# EAGLE design NOROTAE-leddriver (EAGLE 9.3.0)
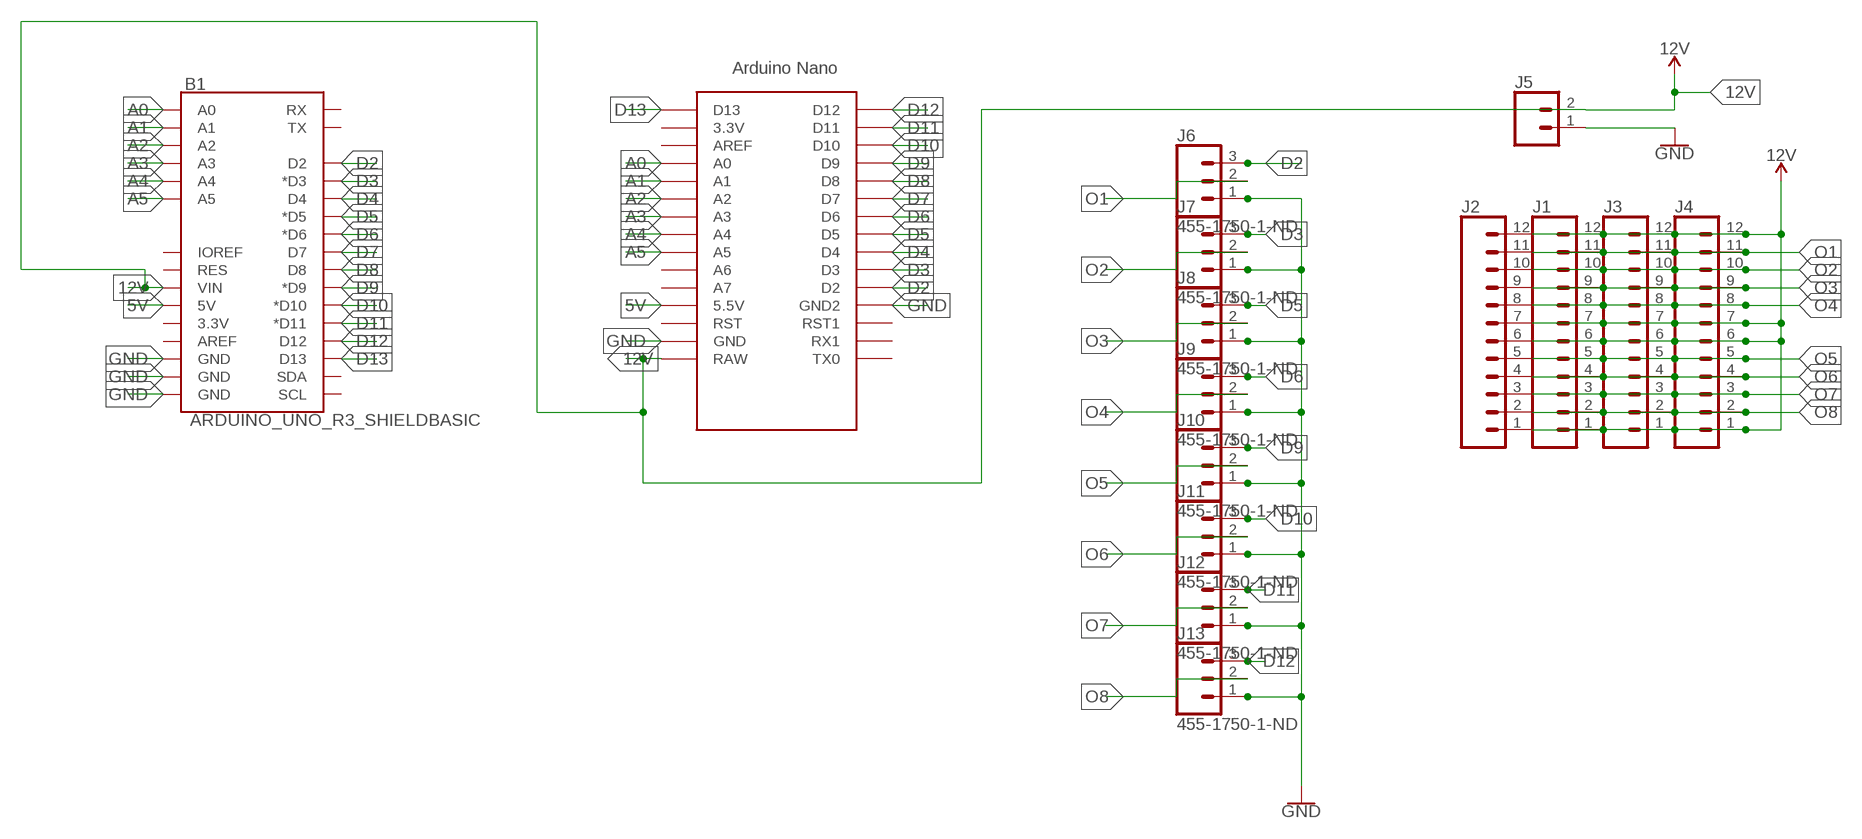
[diagram p0: schematic, sheet 1]

## Parts
B1  ARDUINO_UNO_R3_SHIELDBASIC  [UNO_R3_SHIELD]
J1  CONN_12  [1X12]
J2  CONN_12  [1X12]
J3  CONN_12  [1X12]
J4  CONN_12  [1X12]
J5  CONN_02  [1X02]
J6  455-1750-1-ND  CONN_03  [1X03]
J7  455-1750-1-ND  CONN_03  [1X03]
J8  455-1750-1-ND  CONN_03  [1X03]
J9  455-1750-1-ND  CONN_03  [1X03]
J10  455-1750-1-ND  CONN_03  [1X03]
J11  455-1750-1-ND  CONN_03  [1X03]
J12  455-1750-1-ND  CONN_03  [1X03]
J13  455-1750-1-ND  CONN_03  [1X03]
U$1  NANO  [NANO]

## Nets
5V: B1.5V U$1.5V(5.5V)
12V: B1.VIN J1.1 J1.6 J1.7 J1.12 J2.1 J2.6 J2.7 J2.12 J3.1 J3.6 J3.7 J3.12 J4.1 J4.6 J4.7 J4.12 J5.2 U$1.RAW
A0: B1.A0 U$1.A0
A1: B1.A1 U$1.A1
A2: B1.A2 U$1.A2
A3: B1.A3 U$1.A3
A4: B1.A4 U$1.A4
A5: B1.A5 U$1.A5
D2: B1.D2 J6.3 U$1.D2
D3: B1.D3(*D3) J7.3 U$1.D3
D4: B1.D4 U$1.D4
D5: B1.D5(*D5) J8.3 U$1.D5
D6: B1.D6(*D6) J9.3 U$1.D6
D7: B1.D7 U$1.D7
D8: B1.D8 U$1.D8
D9: B1.D9(*D9) J10.3 U$1.D9
D10: B1.D10(*D10) J11.3 U$1.D10
D11: B1.D11(*D11) J12.3 U$1.D11
D12: B1.D12 J13.3 U$1.D12
D13: B1.D13 U$1.D13
GND: B1.GND@0(GND) B1.GND@1(GND) B1.GND@2(GND) J5.1 J6.1 J7.1 J8.1 J9.1 J10.1 J11.1 J12.1 J13.1 U$1.GND U$1.GND1(GND2)
O1: J1.11 J2.11 J3.11 J4.11 J6.2
O2: J1.10 J2.10 J3.10 J4.10 J7.2
O3: J1.9 J2.9 J3.9 J4.9 J8.2
O4: J1.8 J2.8 J3.8 J4.8 J9.2
O5: J1.5 J2.5 J3.5 J4.5 J10.2
O6: J1.4 J2.4 J3.4 J4.4 J11.2
O7: J1.3 J2.3 J3.3 J4.3 J12.2
O8: J1.2 J2.2 J3.2 J4.2 J13.2
Unconnected: B1.3.3V B1.AREF B1.IOREF B1.RES B1.RX B1.SCL B1.SDA B1.TX U$1.3.3V U$1.A6 U$1.A7 U$1.AREF U$1.ICSP1 U$1.ICSP2 U$1.ICSP3 U$1.ICSP4 U$1.ICSP5 U$1.ICSP6 U$1.RST U$1.RST1 U$1.RX1 U$1.TX0

## Library data of the parts
B1 = SparkFun-Boards:ARDUINO_UNO_R3_SHIELD: Arduino R3 Shield Footprint Shield form compatible with the Arduino Uno R3. SparkFun Products: MG2639 Cellular Shield <https://www.sparkfun.com/products/13120> MIDI Shield <https://www.sparkfun.com/products/12898> R3 Stackable Headers Kit <https://www.sparkfun.com/products/11417>
J1-J4 = SparkFun-Connectors:CONN_12: Multi connection point. Often used as Generic Header-pin footprint for 0.1 inch spaced/style header connections On any of the 0.1 inch spaced packages, you can populate with these: Break Away Headers - Straight <https://www.sparkfun.com/products/116> (PRT-00116) Break Away Male Headers - Right Angle <https://www.sparkfun.com/products/553> (PRT-00553) Female Headers <https://www.sparkfun.com/products/115> (PRT-00115) Break Away Headers - Machine Pin <https://www.sparkfun.com/products/117> (PRT-00117) Break Away Female Headers - Swiss Machine Pin <https://www.sparkfun.com/products/743> (PRT-00743) For SCREWTERMINALS and SPRING TERMINALS visit here: Screw Terimnals on SparkFun.com <https://www.sparkfun.com/search/results?term=Screw+Terminals> (5mm/3.5mm/2.54mm spacing) This device is also useful as a general connection point to wire up your design to another part of your project. Our various solder wires solder well into these plated through hole pads. Hook-Up Wire - Assortment (Stranded, 22 AWG) <https://www.sparkfun.com/products/11375> (PRT-11375) Hook-Up Wire - Assortment (Solid Core, 22 AWG) <https://www.sparkfun.com/products/11367> (PRT-11367) View the entire wire category on our website here <https://www.sparkfun.com/categories/141> Special notes: Molex polarized connector foot print use with SKU : PRT-08231 with associated crimp pins and housings. 1MM SMD Version SKU: PRT-10208 NOTES ON THE VARIANTS LOCK and LOCK_LONGPADS... This footprint was designed to help hold the alignment of a through-hole component (i.e. 6-pin header) while soldering it into place. You may notice that each hole has been shifted either up or down by 0.005 of an inch from it's more standard position (which is a perfectly straight line). This slight alteration caused the pins (the squares in the middle) to touch the edges of the holes. Because they are alternating, it causes a "brace" to hold the component in place. 0.005 has proven to be the perfect amount of "off-center" position when using our standard breakaway headers. Although looks a little odd when you look at the bare footprint, once you have a header in there, the alteration is very hard to notice. Also,if you push a header all the way into place, it is covered up entirely on the bottom side.
J5 = SparkFun-Connectors:CONN_02: Multi connection point. Often used as Generic Header-pin footprint for 0.1 inch spaced/style header connections On any of the 0.1 inch spaced packages, you can populate with these: Break Away Headers - Straight <https://www.sparkfun.com/products/116> (PRT-00116) Break Away Male Headers - Right Angle <https://www.sparkfun.com/products/553> (PRT-00553) Female Headers <https://www.sparkfun.com/products/115> (PRT-00115) Break Away Headers - Machine Pin <https://www.sparkfun.com/products/117> (PRT-00117) Break Away Female Headers - Swiss Machine Pin <https://www.sparkfun.com/products/743> (PRT-00743) For SCREWTERMINALS and SPRING TERMINALS visit here: Screw Terimnals on SparkFun.com <https://www.sparkfun.com/search/results?term=Screw+Terminals> (5mm/3.5mm/2.54mm spacing) This device is also useful as a general connection point to wire up your design to another part of your project. Our various solder wires solder well into these plated through hole pads. Hook-Up Wire - Assortment (Stranded, 22 AWG) <https://www.sparkfun.com/products/11375> (PRT-11375) Hook-Up Wire - Assortment (Solid Core, 22 AWG) <https://www.sparkfun.com/products/11367> (PRT-11367) View the entire wire category on our website here <https://www.sparkfun.com/categories/141> Special notes: Molex polarized connector foot print use with: PRT-08233 with associated crimp pins and housings. 2.54_SCREWTERM for use with PRT-10571. 3.5mm Screw Terminal footprints for PRT-08084 5mm Screw Terminal footprints for use with PRT-08432
J6-J13 = SparkFun-Connectors:CONN_03: Multi connection point. Often used as Generic Header-pin footprint for 0.1 inch spaced/style header connections On any of the 0.1 inch spaced packages, you can populate with these: Break Away Headers - Straight <https://www.sparkfun.com/products/116> (PRT-00116) Break Away Male Headers - Right Angle <https://www.sparkfun.com/products/553> (PRT-00553) Female Headers <https://www.sparkfun.com/products/115> (PRT-00115) Break Away Headers - Machine Pin <https://www.sparkfun.com/products/117> (PRT-00117) Break Away Female Headers - Swiss Machine Pin <https://www.sparkfun.com/products/743> (PRT-00743) Stackable Header - 3 Pin (Female, 0.1") <https://www.sparkfun.com/products/13875> (PRT-13875) For SCREWTERMINALS and SPRING TERMINALS visit here: Screw Terimnals on SparkFun.com <https://www.sparkfun.com/search/results?term=Screw+Terminals> (5mm/3.5mm/2.54mm spacing) This device is also useful as a general connection point to wire up your design to another part of your project. Our various solder wires solder well into these plated through hole pads. Hook-Up Wire - Assortment (Stranded, 22 AWG) <https://www.sparkfun.com/products/11375> (PRT-11375) Hook-Up Wire - Assortment (Solid Core, 22 AWG) <https://www.sparkfun.com/products/11367> (PRT-11367) View the entire wire category on our website here <https://www.sparkfun.com/categories/141> Special notes: Molex polarized connector foot print use with SKU : PRT-08232 with associated crimp pins and housings.; PROD_ID: XXX-00000
U$1 = Arduino-clone:NANO: Arduino Nano

## Board
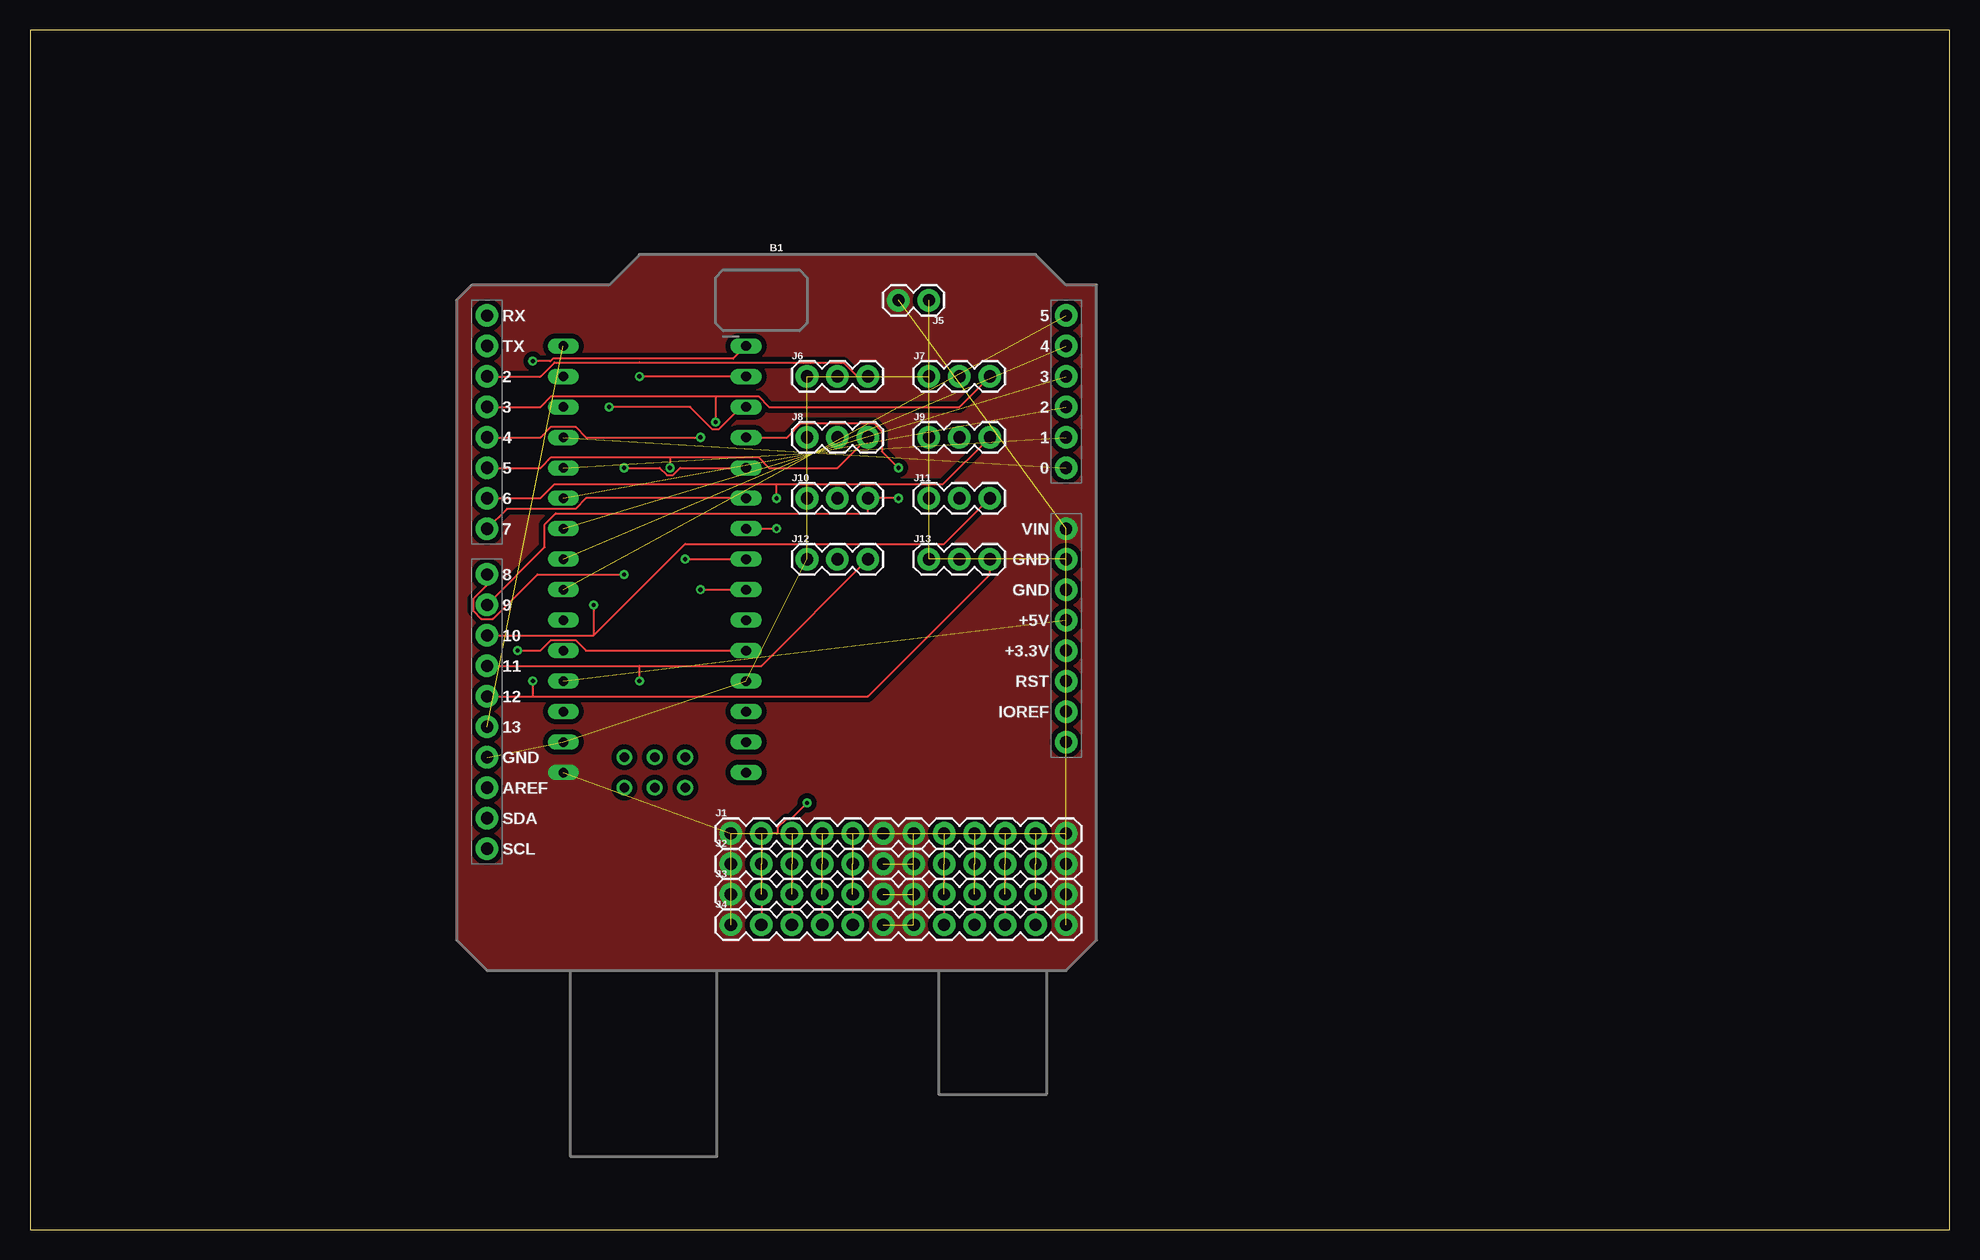
[diagram p1: board, top side]
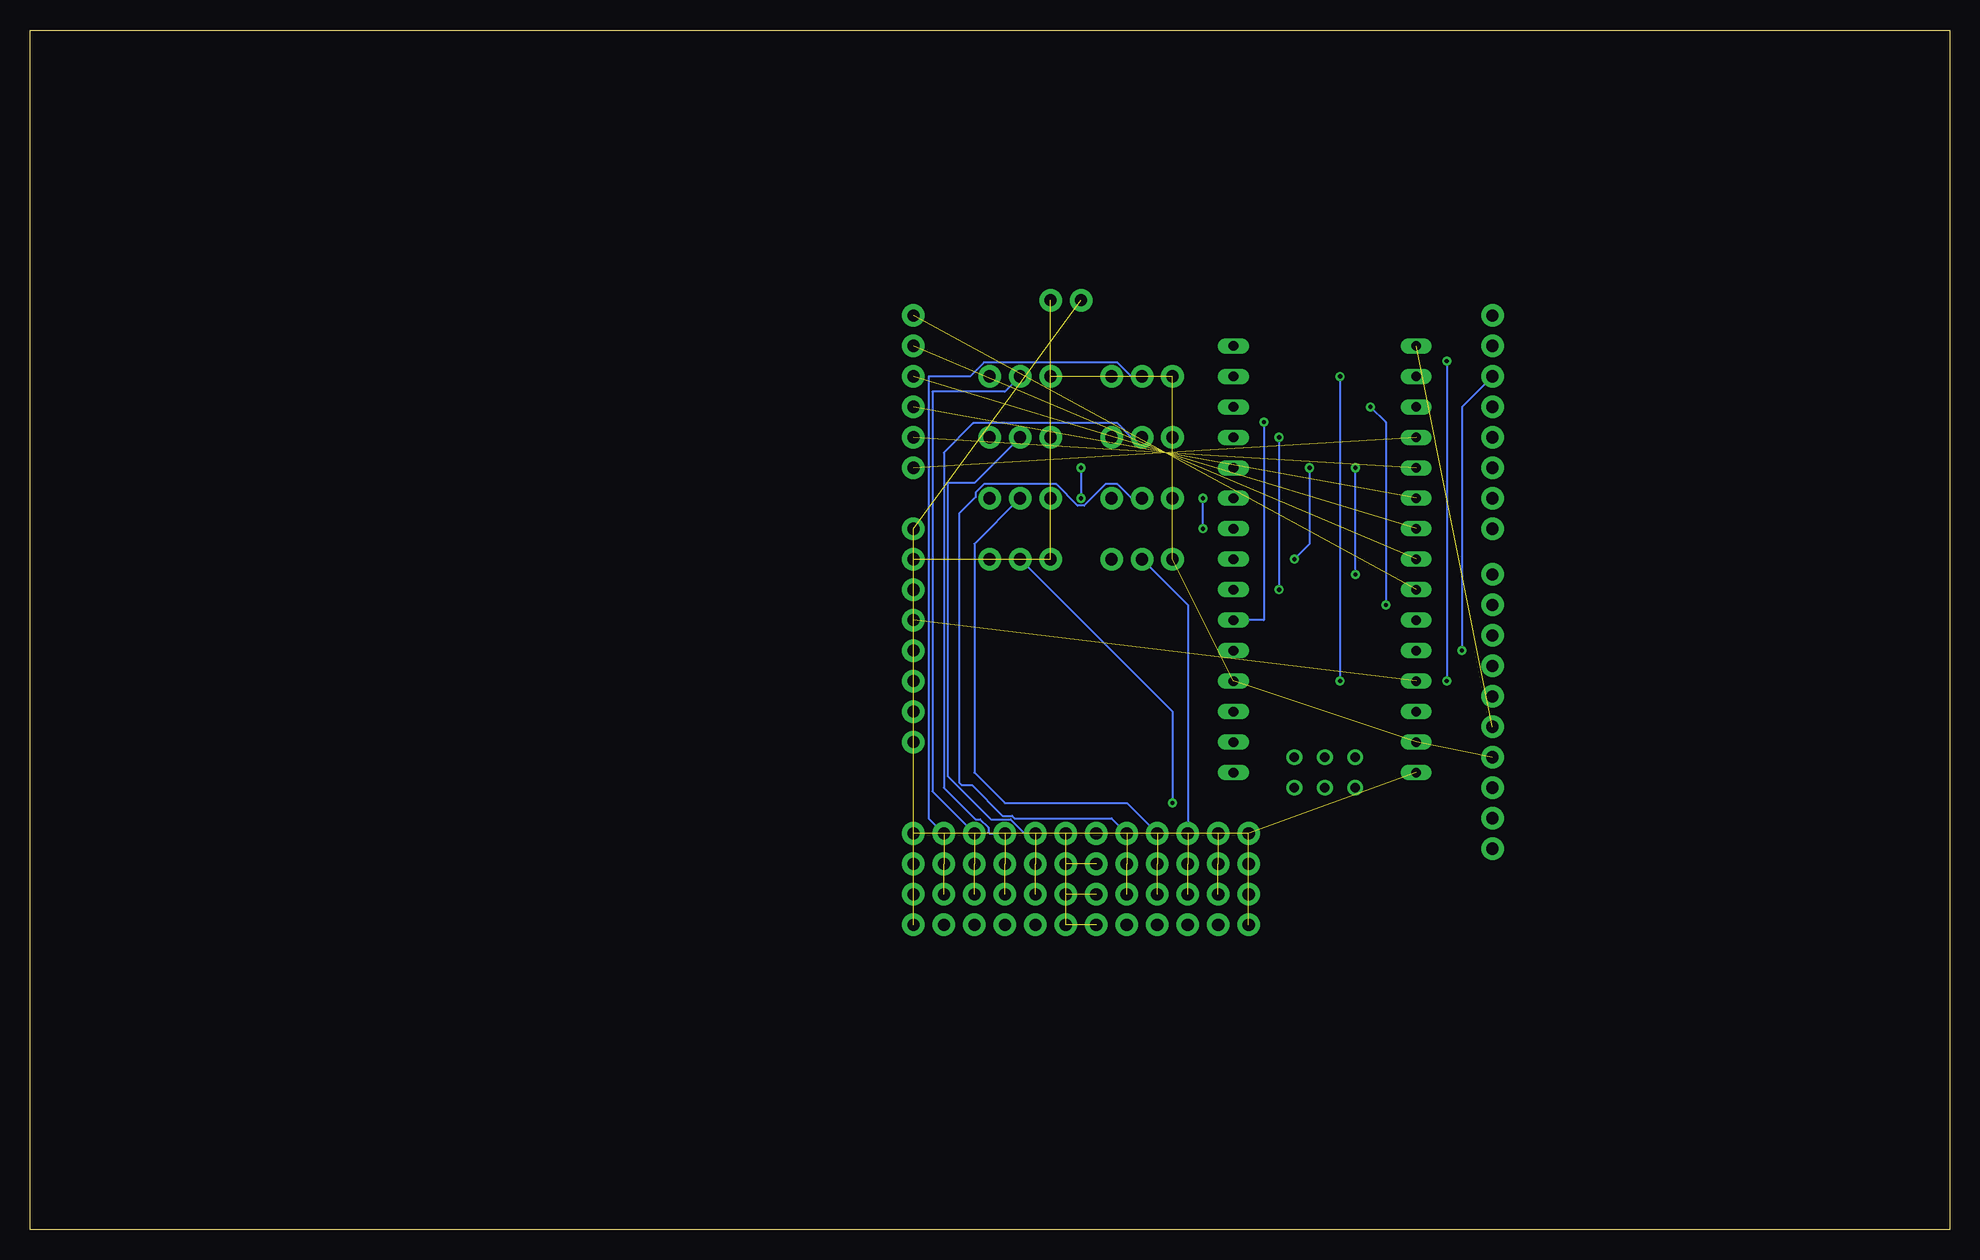
[diagram p2: board, bottom side, seen from below]

Size 160 x 100 mm. Coordinates in mm from the lower left corner, seen from the top.
Outline: 0,0 160,0 160,100 0,100 0,0
Copper layers (1*16): Top 0.035mm / dielectric 1.5mm / Bottom 0.035mm
Design rules "default": minimum track width 6mil, minimum drill 0.35mm, track to track 6mil, track to pad 6mil, pad to pad 6mil, via to via 6mil, smd to smd 6mil, copper to edge 40mil, drill to drill 6mil, minimum pad ring 10mil, minimum via ring 8mil, stop-mask expansion 4mil, vias tented up to drill 0mil, thermal gap 10mil

### Footprints (pad centres in the part's own frame; a part is rotated, then mirrored left to right if it is on the bottom)
UNO_R3_SHIELD = drill 1.016 pad 1.88: 3.3V 24.13,-2.54; 5V 24.13,0; A0 24.13,12.7; A1 24.13,15.24; A2 24.13,17.78; A3 24.13,20.32; A4 24.13,22.86; A5 24.13,25.4; AREF -24.13,-13.97; D2 -24.13,20.32; D3 -24.13,17.78; D4 -24.13,15.24; D5 -24.13,12.7; D6 -24.13,10.16; D7 -24.13,7.62; D8 -24.13,3.81; D9 -24.13,1.27; D10 -24.13,-1.27; D11 -24.13,-3.81; D12 -24.13,-6.35; D13 -24.13,-8.89; GND@0 24.13,2.54; GND@1 24.13,5.08; GND@2 -24.13,-11.43; IOREF 24.13,-7.62; NC 24.13,-10.16; RES 24.13,-5.08; RX -24.13,25.4; SCL -24.13,-19.05; SDA -24.13,-16.51; TX -24.13,22.86; VIN 24.13,7.62
1X12 = drill 1.016 pad 1.88: 1 0,0; 2 2.54,0; 3 5.08,0; 4 7.62,0; 5 10.16,0; 6 12.7,0; 7 15.24,0; 8 17.78,0; 9 20.32,0; 10 22.86,0; 11 25.4,0; 12 27.94,0
1X02 = drill 1.016 pad 1.88: 1 0,0; 2 2.54,0
1X03 = drill 1.016 pad 1.88: 1 0,0; 2 2.54,0; 3 5.08,0
NANO = drill 0.8 long: 3.3V -10.16,24.13; 5V -10.16,-1.27; A0 -10.16,19.05; A1 -10.16,16.51; A2 -10.16,13.97; A3 -10.16,11.43; A4 -10.16,8.89; A5 -10.16,6.35; A6 -10.16,3.81; A7 -10.16,1.27; AREF -10.16,21.59; D2 5.08,1.27; D3 5.08,3.81; D4 5.08,6.35; D5 5.08,8.89; D6 5.08,11.43; D7 5.08,13.97; D8 5.08,16.51; D9 5.08,19.05; D10 5.08,21.59; D11 5.08,24.13; D12 5.08,26.67; D13 -10.16,26.67; GND -10.16,-6.35; GND1 5.08,-1.27; RAW -10.16,-8.89; RST -10.16,-3.81; RST1 5.08,-3.81; RX1 5.08,-6.35; TX0 5.08,-8.89 | drill 0.8: ICSP1 -5.08,-10.16; ICSP2 -5.08,-7.62; ICSP3 -2.54,-10.16; ICSP4 -2.54,-7.62; ICSP5 0,-10.16; ICSP6 0,-7.62

### Placement (x,y rotation side)
B1  62.23,50.8 0 top
J1  58.42,33.02 0 top
J2  58.42,30.48 0 top
J3  58.42,27.94 0 top
J4  58.42,25.4 0 top
J5  74.93,77.47 180 top
J6  64.77,71.12 0 top
J7  74.93,71.12 0 top
J8  64.77,66.04 0 top
J9  74.93,66.04 0 top
J10  64.77,60.96 0 top
J11  74.93,60.96 0 top
J12  64.77,55.88 0 top
J13  74.93,55.88 0 top
U$1  54.61,46.99 0 top

### Tracks (layer width: path | path; a pad name or v marks a point on that pad's centre or on a via)
5V  (1 unrouted)
12V  (18 unrouted)
  pour Top (isolate 0.406, no thermals): 35.56,77.47 36.83,78.74 48.26,78.74 50.8,81.28 83.82,81.28 86.36,78.74 88.9,78.74 88.9,24.13 86.36,21.59 38.1,21.59 35.56,24.13
A0  (1 unrouted)
A1  (1 unrouted)
A2  (1 unrouted)
A3  (1 unrouted)
A4  (1 unrouted)
A5  (1 unrouted)
D2  (via drill 0.35)
  Top 0.152: B1.D2 42.55,71.12 43.72,72.29 50.8,72.29 67.79,72.29 68.96,71.12 J6.3 | v40.64,48.26 42.55,48.26 43.43,49.14 45.47,49.14 46.35,48.26 U$1.D2
  Bottom 0.152: B1.D2 40.64,68.58 v40.64,48.26
D3  (via drill 0.35)
  Top 0.152: J7.3 77.47,68.58 61.59,68.58 60.71,69.46 57.15,69.46 | B1.D3 42.55,68.58 43.43,69.46 57.15,69.46 | 57.15,69.46 v57.15,67.31
  Bottom 0.152: v57.15,67.31 57.15,50.8 U$1.D3
D4  (via drill 0.35)
  Top 0.152: B1.D4 42.55,66.04 43.43,66.92 45.47,66.92 46.35,66.04 v55.88,66.04 | v55.88,53.34 U$1.D4
  Bottom 0.152: v55.88,66.04 v55.88,53.34
D5  (via drill 0.35)
  Top 0.152: J8.3 67.31,63.5 61.59,63.5 60.71,64.38 53.34,64.38 | B1.D5 42.55,63.5 43.43,64.38 53.34,64.38 | 53.34,64.38 v53.34,63.5 | v54.61,55.88 U$1.D5
  Bottom 0.152: v53.34,63.5 53.34,57.15 v54.61,55.88
D6  (via drill 0.35)
  Top 0.152: B1.D6 42.55,60.96 43.72,62.13 62.23,62.13 | J9.3 76.1,62.13 62.23,62.13 | U$1.D6 v62.23,58.42 | v62.23,60.96 62.23,62.13
  Bottom 0.152: v62.23,58.42 v62.23,60.96
D7
  Top 0.152: U$1.D7 46.35,60.96 45.47,60.08 39.76,60.08 B1.D7
D8  (via drill 0.35)
  Top 0.152: v49.53,54.61 42.29,54.61 38.58,50.9 37.62,50.9 36.93,51.59 36.93,52.55 38.1,53.72 B1.D8 | v49.53,63.5 52.48,63.5 53.09,62.89 53.59,62.89 54.2,63.5 U$1.D8
  Bottom 0.152: v49.53,54.61 v49.53,63.5
D9  (via drill 0.35)
  Top 0.152: B1.D9 42.91,56.88 42.91,58.79 43.82,59.69 69.85,59.69 J10.3 v72.39,60.96 | U$1.D9 63.12,66.04 64.29,67.21 70.33,67.21 71.02,66.52 71.02,64.87 v72.39,63.5
  Bottom 0.152: v72.39,63.5 v72.39,60.96
D10  (via drill 0.35)
  Top 0.152: B1.D10 46.99,49.53 | 46.99,49.53 54.61,57.15 76.2,57.15 J11.3 | U$1.D10 59.28,68.58 57.4,66.7 56.9,66.7 55.02,68.58 v48.26,68.58 | v46.99,52.07 46.99,49.53
  Bottom 0.152: v48.26,68.58 46.99,67.31 v46.99,52.07
D11  (via drill 0.35)
  Top 0.152: J12.3 60.96,46.99 50.8,46.99 | B1.D11 50.8,46.99 | U$1.D11 v50.8,71.12 | v50.8,45.72 50.8,46.99
  Bottom 0.152: v50.8,71.12 v50.8,45.72
D12  (via drill 0.35)
  Top 0.152: B1.D12 41.91,44.45 | 41.91,44.45 69.85,44.45 80.01,54.61 J13.3 | U$1.D12 58.62,72.59 43.59,72.59 43.39,72.39 v41.91,72.39 | v41.91,45.72 41.91,44.45
  Bottom 0.152: v41.91,72.39 v41.91,45.72
D13  (1 unrouted)
GND  (13 unrouted)
  cutout Bottom (isolate 0.406, no thermals): 35.56,77.47 36.83,78.74 48.26,78.74 50.8,81.28 83.82,81.28 86.36,78.74 88.9,78.74 88.9,24.13 86.36,21.59 38.1,21.59 35.56,24.13
O1  (2 unrouted)
  Top 0.152: J1.11 J4.11
  Bottom 0.152: J6.2 68.2,71.12 69.37,72.29 80.49,72.29 81.66,71.12 85.09,71.12 85.09,34.29 J1.11
O2  (2 unrouted)
  Top 0.152: J1.10 J4.10
  Bottom 0.152: J7.2 78.74,69.85 84.78,69.85 84.78,36.52 J1.10
O3  (2 unrouted)
  Top 0.152: J1.9 J4.9
  Bottom 0.152: J8.2 68.2,66.04 69.37,67.21 81.38,67.21 83.82,64.77 83.82,36.83 81.18,34.19 80.8,34.19 80.11,33.5 80.11,33.12 80.01,33.02 J1.9
O4  (2 unrouted)
  Top 0.152: J1.8 J4.8
  Bottom 0.152: J9.2 81.28,62.23 83.52,62.23 83.52,37.8 79.91,34.19 78.26,34.19 77.09,33.02 J1.8
O5  (2 unrouted)
  Top 0.152: J1.5 J4.5
  Bottom 0.152: J10.2 68.2,60.96 69.37,62.13 70.36,62.13 72.14,60.35 72.67,60.35 74.45,62.13 80.49,62.13 81.18,61.44 81.18,61.06 82.55,59.69 82.55,37.26 82.33,37.05 81.5,37.05 78.94,34.49 78.13,34.49 77.93,34.29 69.85,34.29 J1.5
O6  (2 unrouted)
  Top 0.152: J1.4 J4.4
  Bottom 0.152: J11.2 81.28,57.15 81.28,38.1 78.74,35.56 68.58,35.56 J1.4
O7  (2 unrouted)
  Top 0.152: J1.3 J4.3
  Bottom 0.152: J12.2 63.5,52.07 J1.3
O8  (via drill 0.35)  (2 unrouted)
  Top 0.152: J4.2 J1.2 62.23,33.02 62.33,33.12 62.33,33.5 63.02,34.19 63.4,34.19 v64.77,35.56
  Bottom 0.152: J13.2 64.77,43.18 v64.77,35.56